# Altium schematic sheet Audio.SchDoc
size A2
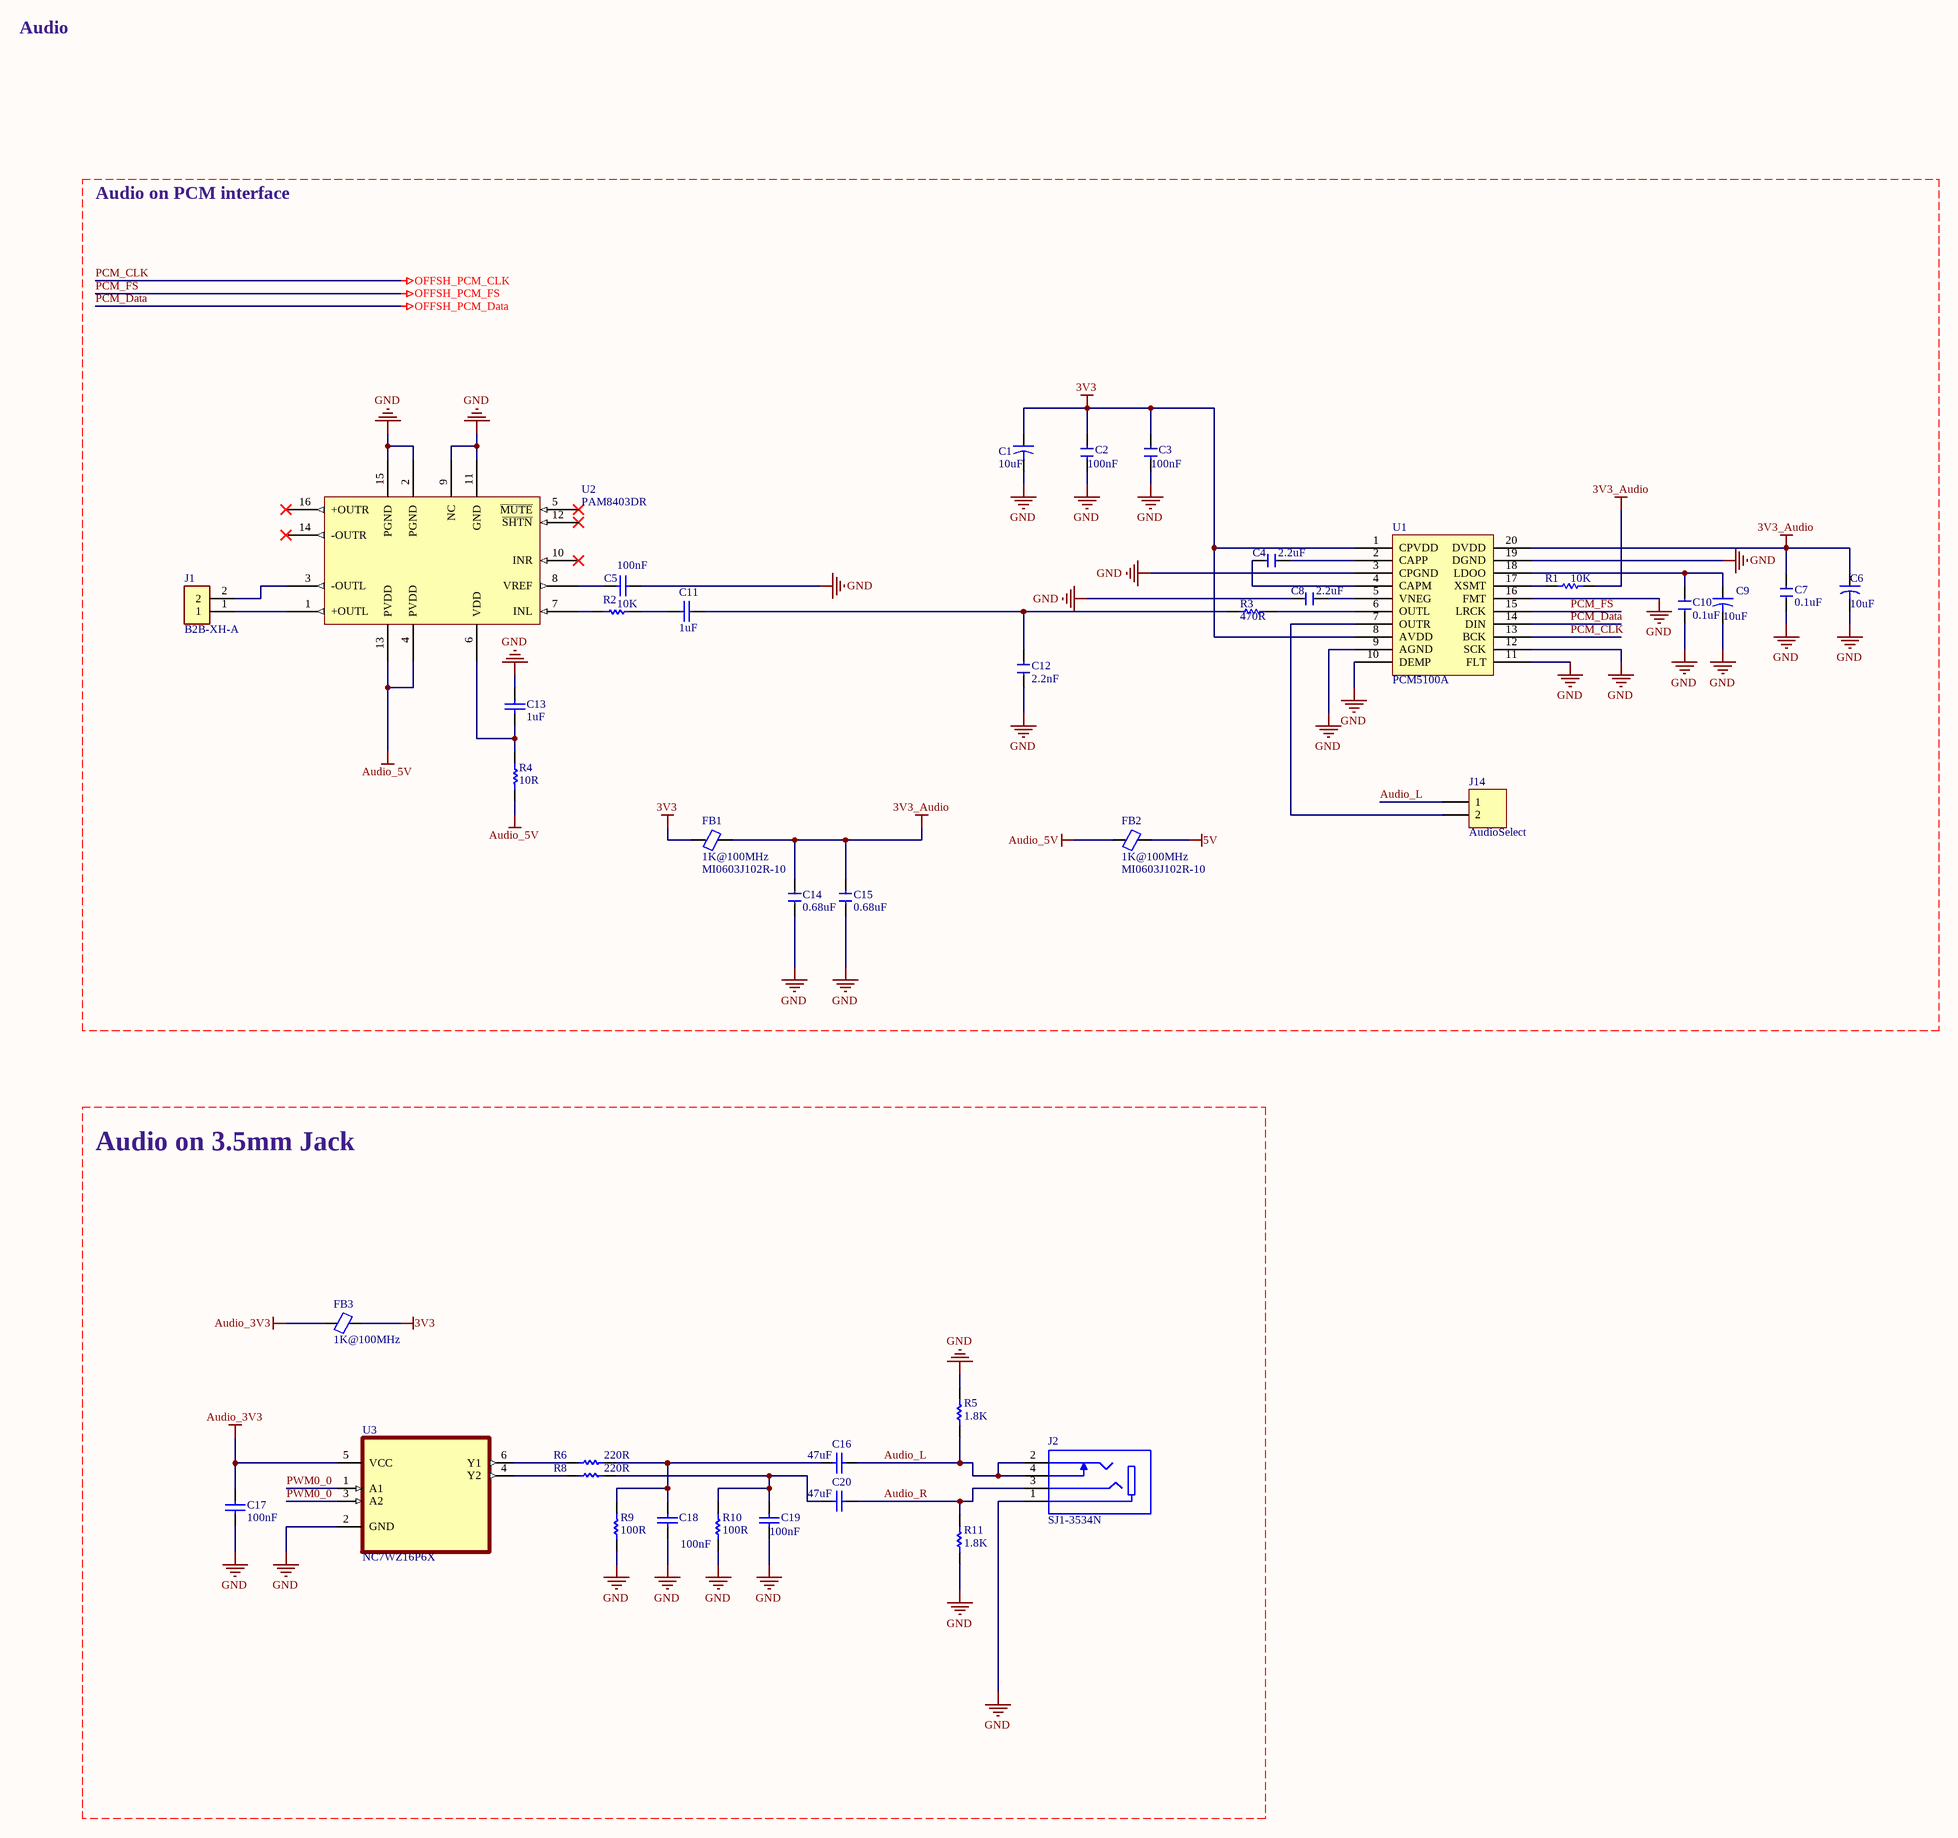
[diagram p0: Audio.SchDoc]

## Parts
C1  value 10uF  [TANTAL (SIZE B)]  (hidden comment: Cap_Tantal)
C2  value 100nF  [0603 Capacitor]  (hidden comment: Ceramic Capacitor SMD)
C3  value 100nF  [0603 Capacitor]  (hidden comment: Ceramic Capacitor SMD)
C4  value 2.2uF  [0603 Capacitor]  (hidden comment: Ceramic Capacitor SMD)
C5  value 100nF  [CAP (0603)]  (hidden comment: Cap)
C6  value 10uF  [TANTAL (SIZE B)]  (hidden comment: Cap_Tantal)
C7  value 0.1uF  [0603 Capacitor]  (hidden comment: Ceramic Capacitor SMD)
C8  value 2.2uF  [0603 Capacitor]  (hidden comment: Ceramic Capacitor SMD)
C9  value 10uF  [TANTAL (SIZE B)]  (hidden comment: Cap_Tantal)
C10  value 0.1uF  [0603 Capacitor]  (hidden comment: Ceramic Capacitor SMD)
C11  value 1uF  [CAP (0603)]  (hidden comment: Cap)
C12  value 2.2nF  [0603 Capacitor]  (hidden comment: Ceramic Capacitor SMD)
C13  value 1uF  [CAP (0603)]  (hidden comment: Cap)
C14  value 0.68uF  [0603 Capacitor]  (hidden comment: Capacitor SMD)
C15  value 0.68uF  [0603 Capacitor]  (hidden comment: Capacitor SMD)
C16  value 47uF  [CAP (0805)]  (hidden comment: Cap)
C17  value 100nF  [CAP (0603)]  (hidden comment: Cap)
C18  value 100nF  [CAP (0603)]  (hidden comment: Cap)
C19  value 100nF  [CAP (0603)]  (hidden comment: Cap)
C20  value 47uF  [CAP (0805)]  (hidden comment: Cap)
FB1  value 1K@100MHz  Part Number: MI0603J102R-10  [FB0603]  (hidden comment: Ferrite Bead)
FB2  value 1K@100MHz  Part Number: MI0603J102R-10  [FB0603]  (hidden comment: Ferrite Bead)
FB3  MI0603J102R-10: 1K@100MHz  [FB0603]  (hidden comment: Ferrite Bead)
J1  XH Connector  [B2B-XH-A]  (value not drawn)
J2  SJ1-3534N  [CUI_SJ1-3534N]
J14  AudioSelect  [HDR1X2]
R1  value 10K  [R0603]  (hidden comment: Res)
R2  value 10K  [RES (0603)]  (hidden comment: Res)
R3  470R  [R0603]
R4  value 10R  [RES (0603)]  (hidden comment: Res)
R5  value 1.8K  [RES (0603)]  (hidden comment: Res)
R6  value 220R  [RES (0603)]  (hidden comment: Res)
R8  value 220R  [RES (0603)]  (hidden comment: Res)
R9  value 100R  [RES (0603)]  (hidden comment: Res)
R10  value 100R  [RES (0603)]  (hidden comment: Res)
R11  value 1.8K  [RES (0603)]  (hidden comment: Res)
U1  PCM5100A  [SOP65P640X120-20N]
U2  Audio Amp  [SOIC127P605X175-16N (SOIC16)]  (value not drawn)
U3  NC7WZ16P6X  [SOT65P210X110-6N]

## Nets
3V3: C1.1 C2.2 C3.2 FB1.1 FB3.2 U1.1(CPVDD) U1.8(AVDD)
3V3_Audio: C6.1 C7.2 C14.1 C15.1 FB1.2 R1.1 U1.20(DVDD)
5V: FB2.2
Audio_3V3: C17.1 FB3.1 U3.5(VCC)
Audio_5V: FB2.1 R4.2 U2.4(PVDD) U2.13(PVDD)
GND: C1.2 C2.1 C3.1 C5.2 C6.2 C7.1 C8.2 C9.2 C10.1 C12.1 C13.1 C14.2 C15.2 C17.2 C18.2 C19.2 J2.1 R5.2 R9.1 R10.1 R11.1 U1.3(CPGND) U1.9(AGND) U1.10(DEMP) U1.11(FLT) U1.12(SCK) U1.16(FMT) U1.19(DGND) U2.2(PGND) U2.9(NC) U2.11(GND) U2.15(PGND) U3.2(GND)
PCM_CLK: U1.13(BCK)  [also labelled OFFSH_PCM_CLK]
PCM_Data: U1.14(DIN)  [also labelled OFFSH_PCM_Data]
PCM_FS: U1.15(LRCK)  [also labelled OFFSH_PCM_FS]
Audio_L: C16.1 J2.2 J2.4 J14.1 R5.1
Audio_R: C20.1 J2.3 R11.2
PWM0_0: U3.1(A1) U3.3(A2)
NetC4_1: C4.1 U1.2(CAPP)
NetC4_2: C4.2 U1.4(CAPM)
NetC5_1: C5.1 U2.8(VREF)
NetC8_1: C8.1 U1.5(VNEG)
NetC9_1: C9.1 C10.2 U1.18(LDOO)
NetC11_1: C11.1 R2.1
NetC11_2: C11.2 C12.2 R3.2
NetC13_2: C13.2 R4.1 U2.6(VDD)
NetC16_2: C16.2 C18.1 R6.2 R9.2
NetC19_1: C19.1 C20.2 R8.2 R10.2
NetJ1_1: J1.1 U2.1(+OUTL)
NetJ1_2: J1.2 U2.3(-OUTL)
NetJ14_2: J14.2 U1.7(OUTR)
NetR1_2: R1.2 U1.17(XSMT)
NetR2_2: R2.2 U2.7(INL)
NetR3_1: R3.1 U1.6(OUTL)
NetR6_1: R6.1 U3.6(Y1)
NetR8_1: R8.1 U3.4(Y2)

Not connected (* = marked no-connect by the designer): U2 5(~{MUTE})* 10(INR)* 12(~{SHTN})* 14(-OUTR)* 16(+OUTR)*

## Notes on the sheet
- Audio
- Audio on PCM interface
- Audio on 3.5mm Jack

## Library data of the parts
C1 C9 = Cap_Tantal: Tantalum Capacitor; Voltage: 10V
  C9: Part Number: Cap_Tantal
C2-C4 C7 C8 C10 C12 = Capacitor Ceramic SMD: Voltage: 10v; Tolerance: *%
C5 C13 C17-C19 = Cap: SMD capacitor; Part Number: SMD CAP (0603); Voltage: 50V
C6 = Cap_Tantal: Tantalum Capacitor; Part Number: Tantal; Voltage: 10V
C11 = Cap: SMD capacitor; part Number: SMD CAP (0603); Voltage: 50V
C14 C15 = Capacitor SMD: Voltage: 50v
C16 C20 = Cap: SMD capacitor; Voltage: 50V
FB1-FB3 = Ferrite Bead: Ferrite Bead SMD; Link: https://www.digikey.com/product-detail/en/laird-signal-integrity-products/MI0805J102R-10/240-2551-1-ND/1015989
J1 = B2B-XH-A: Header Through Hole 2 position (2.50mm); Manufacturer_Name: JST Sales America; Datasheet Link: http://www.jst-mfg.com/product/pdf/eng/eXH.pdf; Height: 7mm; Link: https://www.digikey.sg/product-detail/en/jst-sales-america-inc/B2B-XH-A-LF-SN/455-2247-ND/1651045; Part Number: B2B-XH-A
J2 = SJ1-3534N: 3,5 Ð¼Ð¼, ÑÑ‚ÐµÑ€ÐµÐ¾, Ð¿Ñ€ÑÐ¼Ð¾Ð¹ ÑƒÐ³Ð¾Ð», ÑÐºÐ²Ð¾Ð·Ð½Ð¾Ðµ Ð¾Ñ‚Ð²ÐµÑ€ÑÑ‚Ð¸Ðµ, Ð°ÑƒÐ´Ð¸Ð¾Ñ€Ð°Ð·ÑŠÐµÐ¼; MF: CUI Devices; SnapEDA_Link: https://www.snapeda.com/parts/SJ1-3534N/CUI%20Devices/view-part/576149/?ref=snap; Availability: Unavailable; Value: *; Price: None; MP: SJ1-3534N; Package: None; CUI_purchase_URL: https://www.cuidevices.com/product/interconnect/connectors/audio-connectors/jacks/sj1-353xn-series?utm_source=snapeda.com&utm_medium=referral&utm_campaign=snapedaBOM
J14 = Header 2: Header, 2-Pin; LatestRevisionDate: 17-Jul-2002; LatestRevisionNote: Re-released for DXP Platform.; Publisher: Altium Limited
R1 = Res: Resistor; Published: 8-Jun-2000; LatestRevisionDate: 17-Jul-2002; LatestRevisionNote: Re-released for DXP Platform.; PackageReference: AXIAL-0.3; Publisher: Altium Limited
R2 R4-R6 R8-R11 = Res: SMD resistor; Tolerance: 5%
R3 = Res: Resistor; Value: 470; Published: 8-Jun-2000; LatestRevisionDate: 17-Jul-2002; LatestRevisionNote: Re-released for DXP Platform.; PackageReference: AXIAL-0.3; Publisher: Altium Limited
U2 = PAM8403DR: Stereo Audio Amp; Manufacturer_Name: Diodes Inc.; Datasheet Link: http://docs-emea.rs-online.com/webdocs/1268/0900766b81268cf7.pdf; Height: 1.75mm; Link: https://www.digikey.com/product-detail/en/diodes-incorporated/PAM8403DR/PAM8403DRDICT-ND/8545951; Part Number: PAM8403DR
U3 = NC7WZ16P6X: Buffer, Non-Inverting 2 Element 1 Bit per Element Push-Pull Output SC-88 _SC-70-6_; MF: ON Semiconductor; SnapEDA_Link: https://www.snapeda.com/parts/NC7WZ16P6X/ON%20Semiconductor/view-part/1769774/?ref=snap; Availability: Unavailable; Value: *; Package: SC-70-6 ON Semiconductor; MP: NC7WZ16P6X; Price: None